# EAGLE design LDO (EAGLE 7.7.0)
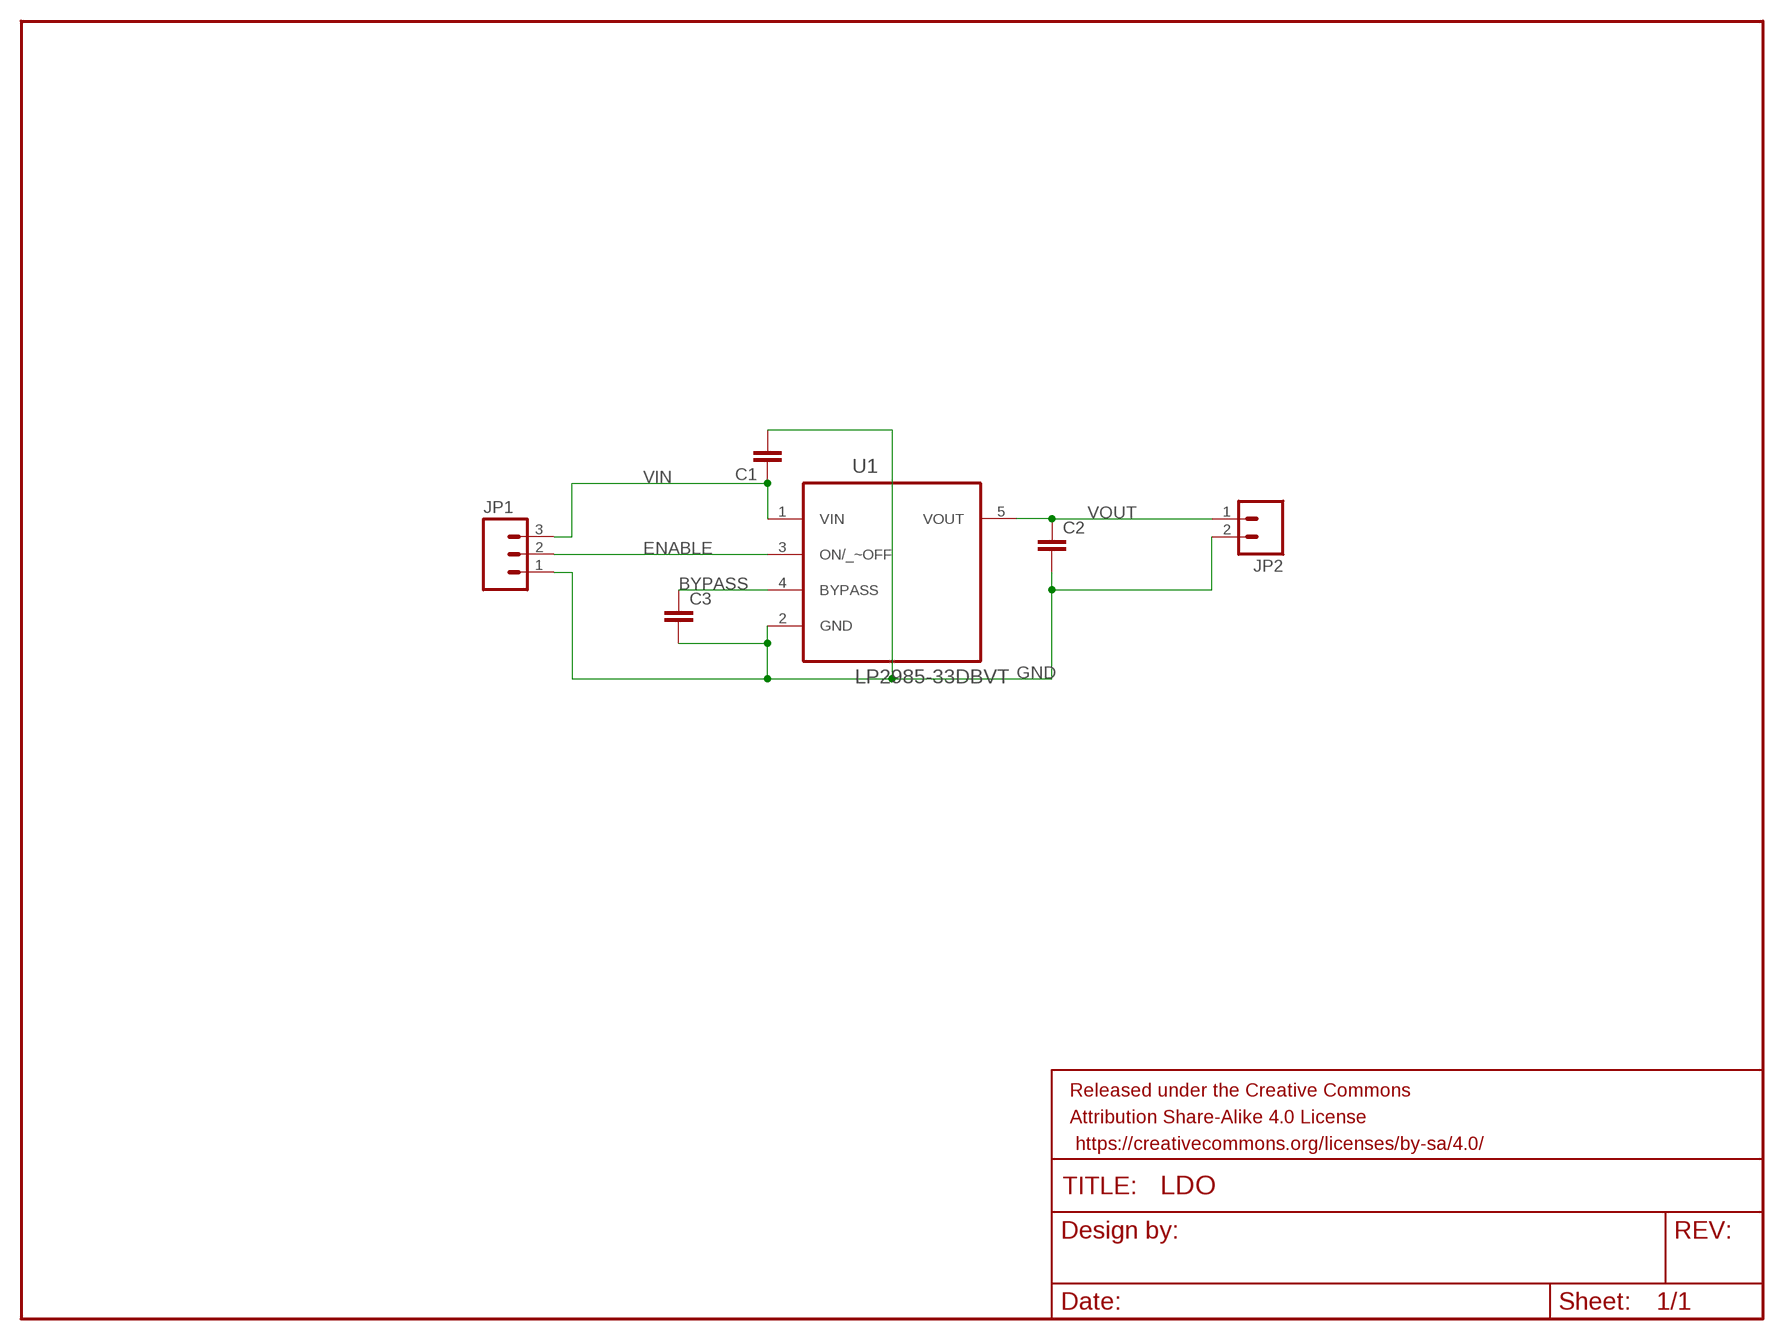
[diagram p0: schematic, sheet 1]

## Parts
C1  CAP0603-CAP  [0603-CAP]
C2  CAP0603-CAP  [0603-CAP]
C3  CAP0603-CAP  [0603-CAP]
FRAME1  FRAME-LETTER  [CREATIVE_COMMONS]
JP1  M03PTH  [1X03]
JP2  M02PTH  [1X02]
U1  LP2985-33DBVT  [SOT95P280X145-5N]

## Nets
BYPASS: C3.1 U1.4(BYPASS)
ENABLE: JP1.2 U1.3(ON/_~OFF)
GND: C1.2 C2.2 C3.2 JP1.1 JP2.2 U1.2(GND)
VIN: C1.1 JP1.3 U1.1(VIN)
VOUT: C2.1 JP2.1 U1.5(VOUT)

## Library data of the parts
C1-C3 = SparkFun-Passives:CAP: Capacitor Standard 0603 ceramic capacitor, and 0.1" leaded capacitor.
FRAME1 = SparkFun-Aesthetics:FRAME-LETTER: Schematic Frame Standard 8.5x11 US Letter frame
JP1 = SparkFun-Connectors:M03: Header 3 Standard 3-pin 0.1" header. Use with straight break away headers (SKU : PRT-00116), right angle break away headers (PRT-00553), swiss pins (PRT-00743), machine pins (PRT-00117), and female headers (PRT-00115). Molex polarized connector foot print use with SKU : PRT-08232 with associated crimp pins and housings.
JP2 = SparkFun-Connectors:M02: Standard 2-pin 0.1" header. Use with - straight break away headers ( PRT-00116) - right angle break away headers (PRT-00553) - swiss pins (PRT-00743) - machine pins (PRT-00117) - female headers (PRT-00115) Molex polarized connector foot print use with: PRT-08233 with associated crimp pins and housings. 2.54_SCREWTERM for use with PRT-10571. 3.5mm Screw Terminal footprints for PRT-08084 5mm Screw Terminal footprints for use with PRT-08432
U1 = LP2985-33DBVT:LP2985-33DBVT: 150-mA LOW-NOISE LOW-DROPOUT REGULATOR WITH SHUTDOWN; AVAILABILITY: Good; DESCRIPTION: Single Output LDO, 150mA, Fixed(3.3V), 1.5% Tolerance, Low Quiescent Current, Low Noise 5-SOT-23 -40 to 125; MF: Texas Instruments; MP: LP2985-33DBVT; PACKAGE: SOT-23 Texas Instruments; PRICE: 0.61 USD

## Board
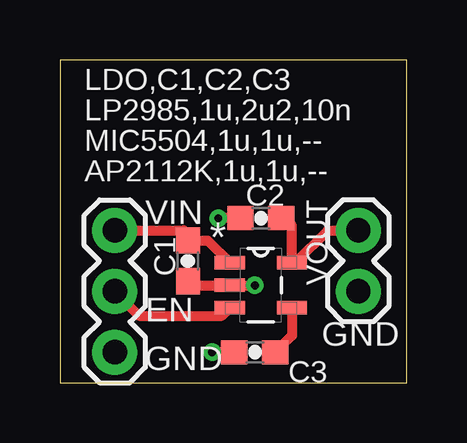
[diagram p1: board, top side]
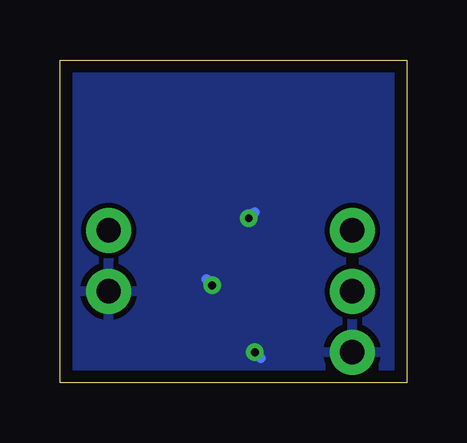
[diagram p2: board, bottom side, seen from below]

Size 14.48 x 13.46 mm. Coordinates in mm from the lower left corner, seen from the top.
Outline: 0,0 14.48,0 14.48,13.46 0,13.46 0,0
Copper layers (1*16): Top 0.035mm / dielectric 1.5mm / Bottom 0.035mm
Design rules "default *": minimum track width 10mil, minimum drill 24mil, track to track 8mil, track to pad 8mil, pad to pad 8mil, via to via 8mil, smd to smd 8mil, copper to edge 20mil, drill to drill 8mil, minimum pad ring 10mil, minimum via ring 8mil, stop-mask expansion 4mil, vias tented up to drill 13mil, thermal gap 10mil

### Footprints (pad centres in the part's own frame; a part is rotated, then mirrored left to right if it is on the bottom)
0603-CAP = smd 1.1 x 1: 1 -0.85,0; 2 0.85,0
1X03 = drill 1.016 pad 1.88: 1 0,0; 2 2.54,0; 3 5.08,0
1X02 = drill 1.016 pad 1.88: 1 0,0; 2 2.54,0
SOT95P280X145-5N = smd 1.27 x 0.559: 1 -1.295,0.94; 2 -1.295,0; 3 -1.295,-0.94; 4 1.295,-0.94; 5 1.295,0.94

### Placement (x,y rotation side)
C1  5.33,5.08 270 top
C2  8.38,6.86 180 top
C3  8.13,1.27 180 top
FRAME1  13.97,-15.75 0 top  (outside the outline)
JP1  2.29,1.27 90 top
JP2  12.45,6.35 270 top
U1  8.38,4.06 0 top

### Tracks (layer width: path | path; a pad name or v marks a point on that pad's centre or on a via)
BYPASS
  Top 0.406: U1.4 9.68,1.97 C3.1
ENABLE
  Top 0.406: JP1.2 3.3,2.79 6.76,2.79 U1.3
GND  (via drill 0.33)
  Top 0.406: C1.2 5.17,4.23 5.59,4.06 U1.2 v8.13,4.06 | C2.2 v6.6,6.86 | C3.2 v6.35,1.27
  Bottom 0.406: v8.13,4.06 8.38,4.32 | v6.6,6.86 6.35,7.11 | v6.35,1.27 6.1,1.02
  pour Bottom: 0,15.24 14.73,15.24 14.73,-1.78 0,-1.78
VIN
  Top 0.406: JP1.3 5.17,6.35 C1.1 6.16,5.93 U1.1
VOUT
  Top 0.406: C2.1 9.4,6.86 9.65,6.6 9.65,5.03 U1.5 9.83,5 11.18,6.35 JP2.1

### Text on the board
tNames: LDO,C1,C2,C3 | LP2985,1u,2u2,10n | MIC5504,1u,1u,-- | AP2112K,1u,1u,-- | VIN | VOUT | EN | GND | GND